# EAGLE design nunchuck v0.5.2 (EAGLE 7.3.0)
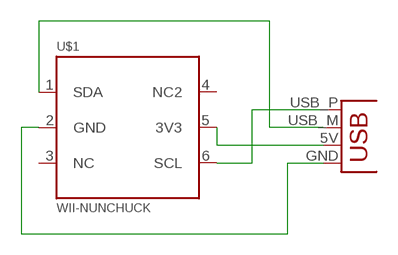
[diagram p0: schematic, sheet 1]

## Parts
JP1  USBPCB  [USB-A-PCB]
U$1  WII-NUNCHUCK  [WII_6PIN]

## Nets
N$1: JP1.USB_P(D+) U$1.6(SCL)
N$3: JP1.USB_M(D-) U$1.1(SDA)
N$4: JP1.GND U$1.2(GND)
N$5: JP1.5V(VBUS) U$1.5(3V3)
Unconnected: U$1.4(NC2)

## Power pins joined to a net without a drawn wire
NC: U$1.3(NC)

## Library data of the parts
JP1 = comingle:USB
U$1 = comingle:WII-NUNCHUCK

## Board
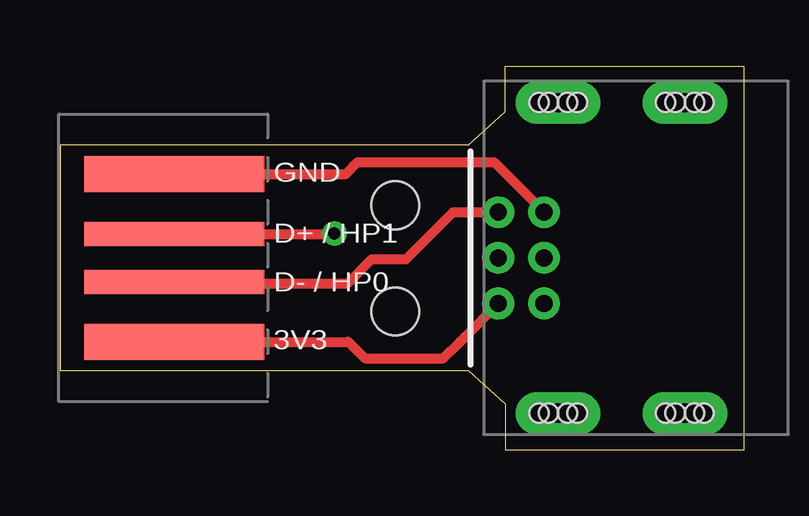
[diagram p1: board, top side]
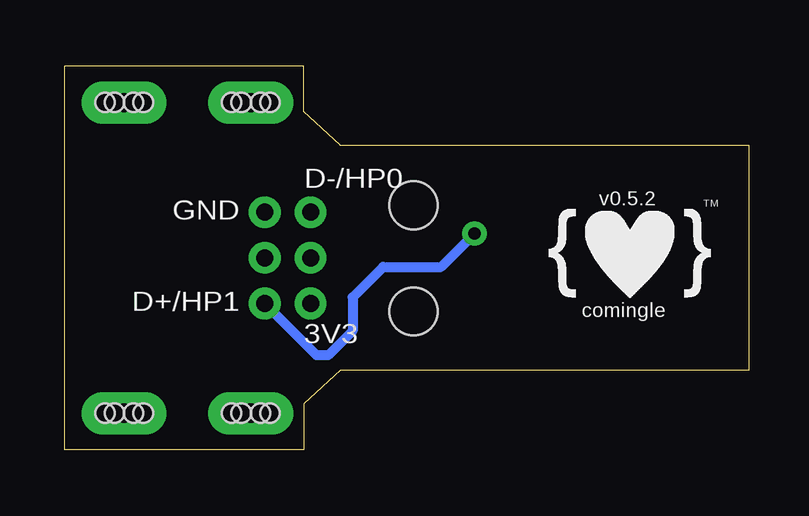
[diagram p2: board, bottom side, seen from below]

Size 28.51 x 16 mm. Coordinates in mm from the lower left corner, seen from the top.
Outline: 17.04,12.7 17.02,12.7
Outline: 17.02,12.7 0,12.7 0,3.3 17.02,3.3 18.54,1.91 18.54,0 28.51,0 28.51,16 18.54,16 18.54,14.1 17.02,12.7
Copper layers (1*16): Top 0.035mm / dielectric 1.5mm / Bottom 0.035mm
Design rules "SparkFun-2-layer": minimum track width 7mil, minimum drill 15mil, track to track 8mil, track to pad 8mil, pad to pad 8mil, via to via 8mil, smd to smd 8mil, copper to edge 8mil, drill to drill 8mil, minimum pad ring 12mil, minimum via ring 10mil, stop-mask expansion 4mil, vias tented up to drill 20mil, thermal gap 10mil
Holes 2 mm at 13.97,10.19 13.97,5.77

### Footprints (pad centres in the part's own frame; a part is rotated, then mirrored left to right if it is on the bottom)
USB-A-PCB = smd 7.5 x 1.5: 5V -0.2,-3.5; GND -0.2,3.5 | smd 7.5 x 1: USB_M -0.2,-1; USB_P -0.2,1
WII_6PIN = drill 0.711: 1 -1.905,-5.74; 2 -1.905,-3.835; 3 0,-5.74; 4 0,-3.835; 5 1.905,-5.74; 6 1.905,-3.835 | drill 0.8 pad 1.778 long: P$7 -6.477,-3.251; P$8 -6.477,2.032; P$9 6.477,2.032; P$10 6.477,-3.251 | hole 0.8: -6.477,1.632; -6.477,1.232; -6.477,2.432; -6.477,2.832; 6.477,1.632; 6.477,1.232; 6.477,2.432; 6.477,2.832; 6.477,-3.651; 6.477,-4.051; 6.477,-2.851; 6.477,-2.451; -6.477,-3.651; -6.477,-4.051; -6.477,-2.851; -6.477,-2.451

### Placement (x,y rotation side)
JP1  4.95,8 0 top
U$1  24,8 270 top

### Tracks (layer width: path | path; a pad name or v marks a point on that pad's centre or on a via)
N$1  (via drill 0.51)
  Top 0.406: JP1.USB_P 11.41,9 v11.43,9.02
  Bottom 0.406: 11.43,8.89 v11.43,9.02 12.83,7.62 15.24,7.62 16.51,6.35 16.51,4.95 17.53,3.94 18.01,3.94 U$1.6
N$3
  Top 0.406: 5.25,6.94 5.77,6.94 | U$1.1 16.38,9.91 14.43,7.95 12.99,7.95 11.98,6.94 5.77,6.94 | JP1.USB_M 5.77,7 5.77,6.94
N$4
  Top 0.406: U$1.2 18.09,11.98 12.39,11.98 11.91,11.5 JP1.GND
N$5
  Top 0.406: U$1.5 16.88,4.71 16.67,4.5 15.98,3.81 12.7,3.81 12.01,4.5 JP1.5V

### Text on the board
bPlace: TM | v0.5.2 | comingle
tNames: GND | D+ / HP1 | D- / HP0 | 3V3
bNames: D-/HP0 | GND | D+/HP1 | 3V3